# EAGLE schematic MCP73871_Solar (EAGLE 6.2)
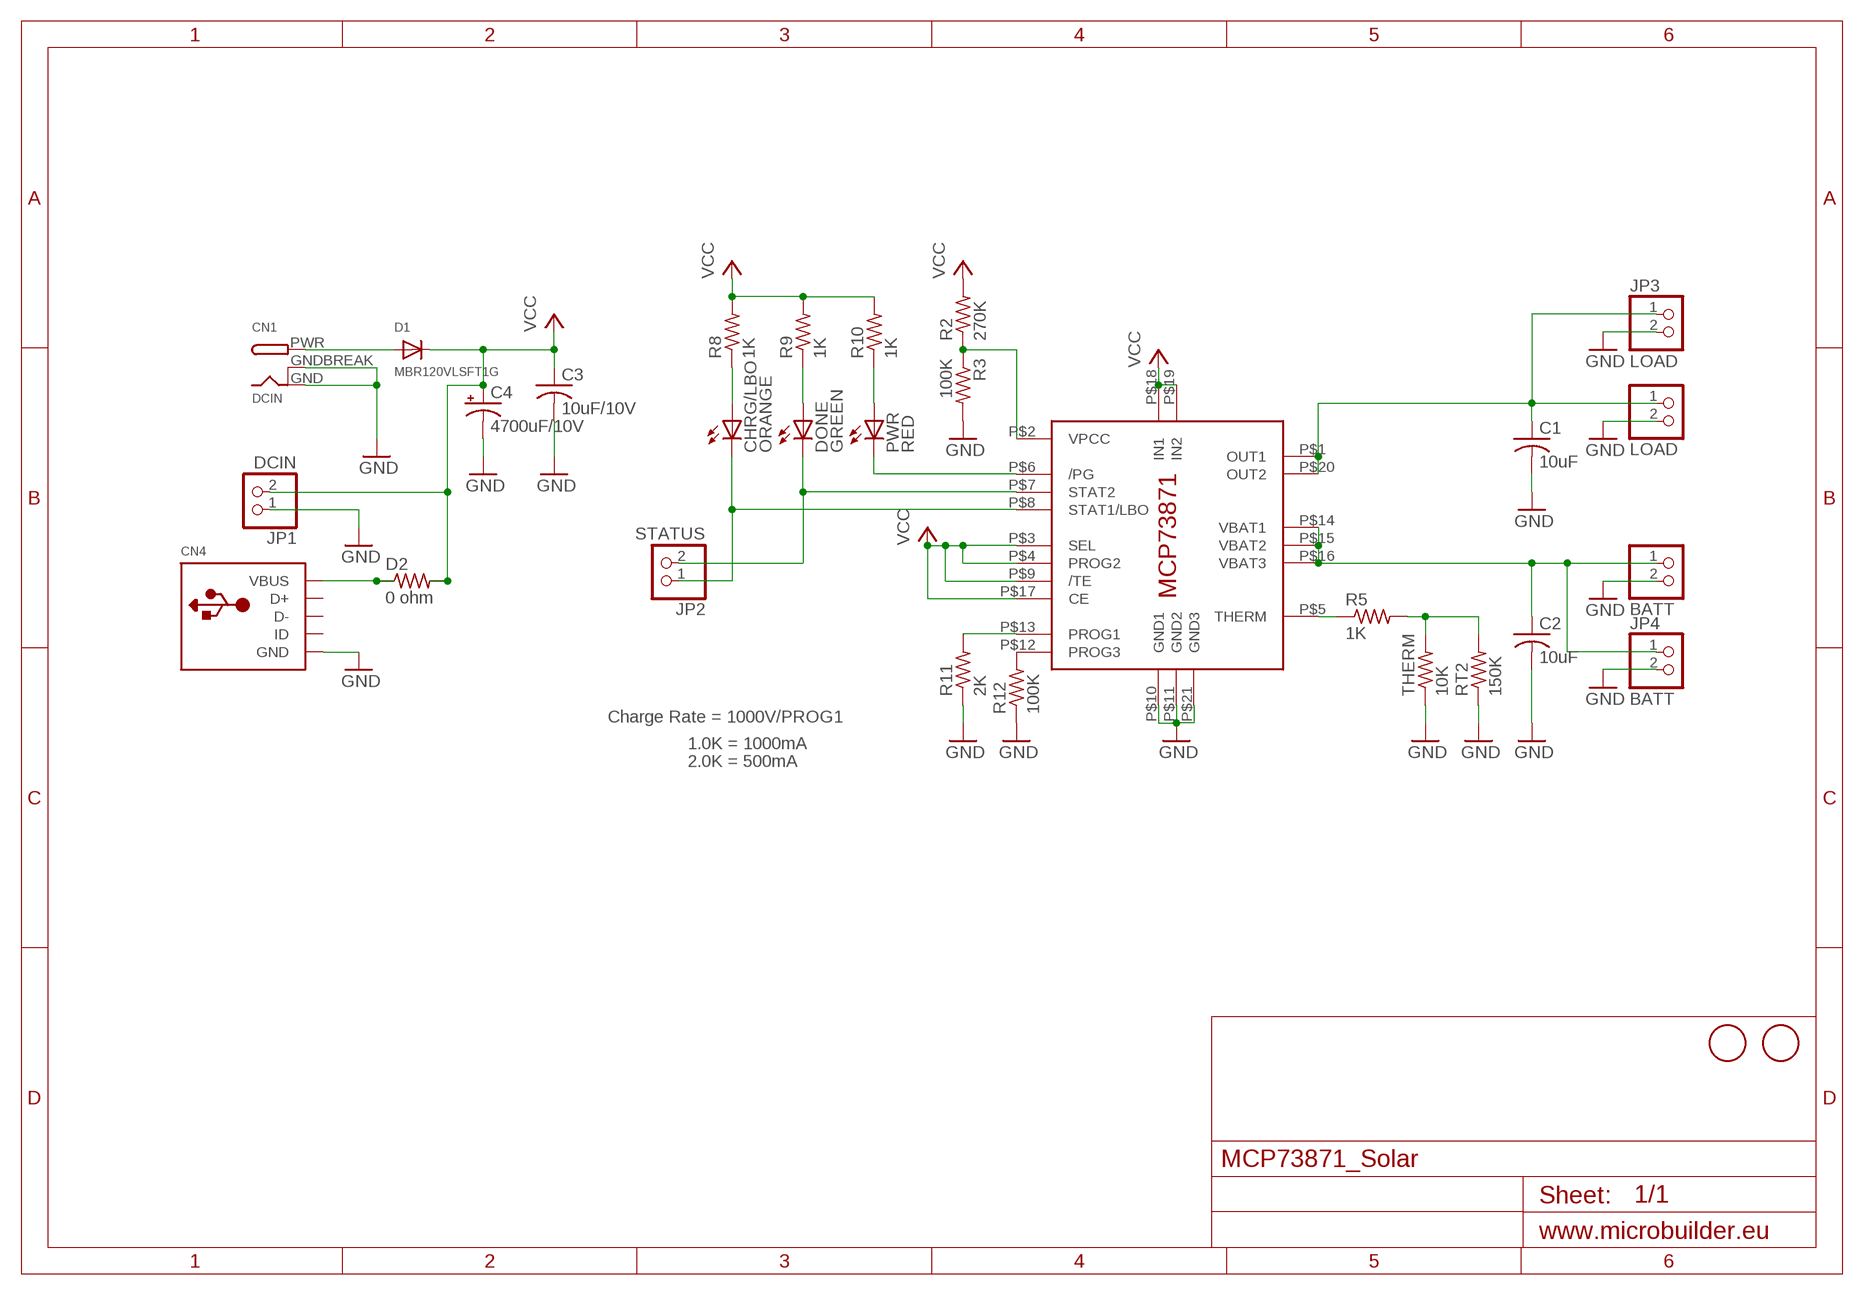
[diagram p0: schematic, sheet 1]

## Parts
BATT  JST_2PIN-SMT-RA  [JST-PH-2-SMT-RA]
C1  10uF  C-USC0805K  [C0805K]
C2  10uF  C-USC0805K  [C0805K]
C3  10uF/10V  C-USC0805K  [C0805K]
C4  4700uF/10V  CPOL-USE5-13  [E5-13]
CHRG/LBO  ORANGE  LEDCHIP-LED0805  [CHIP-LED0805]
CN1  DCIN  DCBARREL1.3MM  [DCJACK_1.3MM_PTH]
CN4  USBMINIB  [USB-MINIB]
D1  MBR120VLSFT1G  DIODESOD-123  [SOD-123]
D2  0 ohm  R-US_R0805  [R0805]
DONE  GREEN  LEDCHIP-LED0805  [CHIP-LED0805]
IC1  MCP73871  [QFN20_4MM]
JP1  DCIN  HEADER-1X2  [1X02_OVAL]
JP2  STATUS  HEADER-1X2  [1X02_OVAL]
JP3  LOAD  HEADER-1X2  [1X02_OVAL]
JP4  BATT  HEADER-1X2  [1X02_OVAL]
LOAD  JST_2PIN-SMT-RA  [JST-PH-2-SMT-RA]
PWR  RED  LEDCHIP-LED0805  [CHIP-LED0805]
R2  270K  R-US_R0805  [R0805]
R3  100K  R-US_R0805  [R0805]
R5  1K  R-US_M0805  [M0805]
R8  1K  R-US_R0805  [R0805]
R9  1K  R-US_R0805  [R0805]
R10  1K  R-US_R0805  [R0805]
R11  2K  R-US_FLIPFLOP  [0805-THM]
R12  100K  R-US_R0805  [R0805]
RT2  150K  R-US_M0805  [M0805]
THERM  10K  R-US_FLIPFLOP  [0805-THM]
U$2  FIDUCIAL  [FIDUCIAL_1MM]
U$3  FIDUCIAL  [FIDUCIAL_1MM]

## Nets
BATT: BATT.1 C2.1 IC1.P$14(VBAT1) IC1.P$15(VBAT2) IC1.P$16(VBAT3) JP4.1
GND: BATT.2 C1.2 C2.2 C3.2 C4.- CN1.GND CN1.GNDBREAK CN4.GND IC1.P$10(GND1) IC1.P$11(GND2) IC1.P$21(GND3) JP1.1 JP3.2 JP4.2 LOAD.2 R3.2 R11.1 R12.1 RT2.1 THERM.1
N$1: IC1.P$6(/PG) PWR.C
N$2: CN4.VBUS D2.1
N$4: DONE.C IC1.P$7(STAT2) JP2.2
N$5: IC1.P$5(THERM) R5.1
N$6: IC1.P$2(VPCC) R2.1 R3.1
N$7: C1.1 IC1.P$1(OUT1) IC1.P$20(OUT2) JP3.1 LOAD.1
N$8: R5.2 RT2.2 THERM.2
N$10: CN1.PWR D1.A
N$11: CHRG/LBO.C IC1.P$8(STAT1/LBO) JP2.1
N$12: CHRG/LBO.A R8.1
N$13: DONE.A R9.1
N$14: PWR.A R10.1
N$15: IC1.P$12(PROG3) R12.2
N$16: IC1.P$13(PROG1) R11.2
VCC: C3.1 C4.+ D1.C D2.2 IC1.P$3(SEL) IC1.P$4(PROG2) IC1.P$9(/TE) IC1.P$17(CE) IC1.P$18(IN1) IC1.P$19(IN2) JP1.2 R2.2 R8.2 R9.2 R10.2
Unconnected: CN4.D+ CN4.D- CN4.ID

## Notes on the sheet
- Charge Rate = 1000V/PROG1
- 1.0K = 1000mA
- 2.0K = 500mA

## Library data of the parts
BATT LOAD = adafruit:JST_2PIN: JST 2-Pin Connectors of various flavors SMT-RA (S2B-PH-SM4) 4UConnector #17311 SMT (B2B-PH-SM4) THM-RA (S2B-PH) THM (B2B-PH)
C1-C3 = adafruit:C-US: CAPACITOR, American symbol
C4 = adafruit:CPOL-US: POLARIZED CAPACITOR, American symbol
CHRG/LBO DONE PWR = adafruit:LED: LED OSRAM: - CHIPLED LG R971, LG N971, LY N971, LG Q971, LY Q971, LO R971, LY R971 LH N974, LH R974 LS Q976, LO Q976, LY Q976 LO Q996 - Hyper CHIPLED LW Q18S LB Q993, LB Q99A, LB R99A - SideLED LS A670, LO A670, LY A670, LG A670, LP A670 LB A673, LV A673, LT A673, LW A673 LH A674 LY A675 LS A676, LA A676, LO A676, LY A676, LW A676 LS A679, LY A679, LG A679 - Hyper Micro SIDELED® LS Y876, LA Y876, LO Y876, LY Y876 LT Y87S - SmartLED LW L88C, LW L88S LB L89C, LB L89S, LG L890 LS L89K, LO L89K, LY L89K LS L896, LA L896, LO L896, LY L896 - TOPLED LS T670, LO T670, LY T670, LG T670, LP T670 LSG T670, LSP T670, LSY T670, LOP T670, LYG T670 LG T671, LOG T671, LSG T671 LB T673, LV T673, LT T673, LW T673 LH T674 LS T676, LA T676, LO T676, LY T676, LB T676, LH T676, LSB T676, LW T676 LB T67C, LV T67C, LT T67C, LS T67K, LO T67K, LY T67K, LW E67C LS E67B, LA E67B, LO E67B, LY E67B, LB E67C, LV E67C, LT E67C LW T67C LS T679, LY T679, LG T679 LS T770, LO T770, LY T770, LG T770, LP T770 LB T773, LV T773, LT T773, LW T773 LH T774 LS E675, LA E675, LY E675, LS T675 LS T776, LA T776, LO T776, LY T776, LB T776 LHGB T686 LT T68C, LB T68C - Hyper Mini TOPLED® LB M676 - Mini TOPLED Santana® LG M470 LS M47K, LO M47K, LY M47K Source: http://www.osram.convergy.de/
CN1 = microbuilder:DCBARREL: DC Barrel Jack DCJACK_1.3MM_PTH - Through Hole 1.3mm Jack (4UConnector: 05536) DCJACK_2MM_PTH - Through Hole 2.0/2.1 Jack (4UConnector: 05537) DCJACK_2MM_SMT - SMT 2.0/2.1mm Jack(4UConnector: 03267)
CN4 = adafruit:USB: USB Connectors USBMINIB - Surface Mount Female Mini-B USB Connector 4UConnector: 06564 By microbuilder.eu Thru-hole RA Female Mini-B USB Connector 4UConnector: 18732 By ladyada.net
D1 = microbuilder:DIODE: Diode SMADIODE - SMA Surface Mount Package 20V 1A Schottky Diode Digikey (500mV @ 1A, 500uA Vr @ 20V): 641-1014-6-ND SOD-123 30V 500mA (430mV Vf, 130uA Vr @ 30V) Schottky Diode - Digikey: B0530W-FDICT-ND SOD-323 10V 570mA (380mV Vf, 3ns) Schottky Diode - Digikey: ZLLS410CT-ND 1N4148WS - 75V 150mA (1V Vf @ 10mA, 4ns) Simple Diode - Digikey: 1N4148WSFSCT-ND, Mouser: 512-1N4148WS SOD-523 30V 30mA Schottky Diode (RB751S-40TE61) - Digikey: RB751S-40TE61CT-ND SOT23-R/W - SOT23 Package (R = Solder Paste/Reflow Ovens, W = Hand-Soldering) BAT54Film 40V 300mA - Digikey: 497-7162-1-ND DO-1N4148 Through Hole Small Current Diode (any model)
D2 R2 R3 R5 R8-R12 RT2 THERM = adafruit:R-US_: RESISTOR, American symbol
IC1 = adafruit:MCP73871
JP1-JP4 = microbuilder:HEADER-1X2: PIN HEADER
U$2 U$3 = adafruit:FIDUCIAL: For use by pick and place machines to calibrate the vision/machine, 1mm By microbuilder.eu